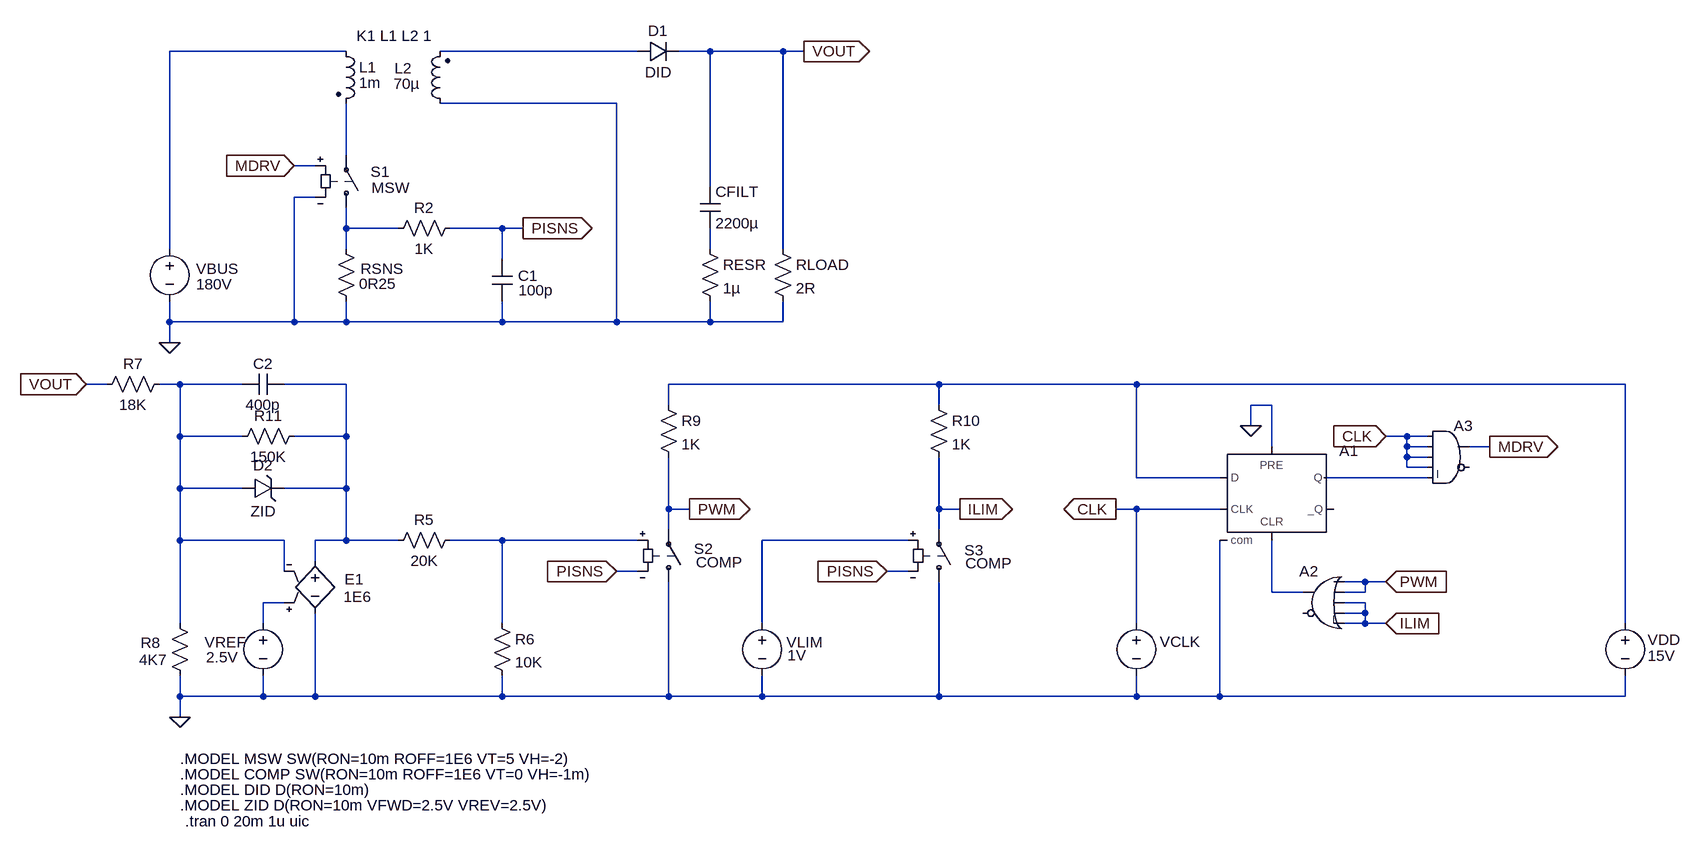
[diagram p0: schematic 384x_Flyback.asc]
384x_Flyback.asc, the LTspice schematic file:
Version 4
SHEET 1 2288 1304
WIRE 224 256 224 176
WIRE 224 336 224 368
WIRE 224 368 304 368
WIRE 224 368 224 400
WIRE 464 416 464 368
WIRE 464 368 384 368
WIRE 464 480 464 512
WIRE 464 512 224 512
WIRE 224 512 224 480
WIRE 496 368 464 368
WIRE 368 176 640 176
WIRE 640 176 640 512
WIRE 640 512 464 512
WIRE 672 96 368 96
WIRE 176 320 144 320
WIRE 144 320 144 512
WIRE 144 512 224 512
WIRE 176 272 144 272
WIRE 784 304 784 96
WIRE 784 96 736 96
WIRE 784 368 784 400
WIRE 784 480 784 512
WIRE 784 512 640 512
WIRE 224 96 -48 96
WIRE -48 96 -48 400
WIRE -48 480 -48 512
WIRE -48 512 144 512
WIRE -48 544 -48 512
WIRE 896 400 896 96
WIRE 896 96 784 96
WIRE 896 480 896 512
WIRE 896 512 784 512
WIRE 96 976 96 944
WIRE 96 944 128 944
WIRE 96 1056 96 1088
WIRE 176 960 176 1088
WIRE 176 1088 96 1088
WIRE 176 880 176 848
WIRE 176 848 224 848
WIRE 384 848 464 848
WIRE 464 848 464 976
WIRE 464 1056 464 1088
WIRE 464 1088 176 1088
WIRE 672 848 464 848
WIRE 672 896 640 896
WIRE 720 912 720 1088
WIRE 720 1088 464 1088
WIRE 1088 896 1056 896
WIRE 1136 912 1136 1088
WIRE 864 976 864 848
WIRE 864 848 1088 848
WIRE 864 1056 864 1088
WIRE 864 1088 1136 1088
WIRE -32 848 -32 976
WIRE -32 848 128 848
WIRE 128 848 128 896
WIRE -32 1056 -32 1088
WIRE -144 608 -176 608
WIRE 928 96 896 96
WIRE 96 1088 -32 1088
WIRE -32 1088 -32 1120
WIRE 720 1088 864 1088
WIRE 720 720 720 800
WIRE 1136 720 1136 800
WIRE 752 800 720 800
WIRE 720 800 720 832
WIRE 1168 800 1136 800
WIRE 1136 800 1136 832
WIRE 720 640 720 608
WIRE 720 608 1136 608
WIRE 1136 640 1136 608
WIRE 1136 608 1440 608
WIRE 1440 976 1440 800
WIRE 1440 800 1568 800
WIRE 1440 1056 1440 1088
WIRE 1440 1088 1136 1088
WIRE 1440 800 1408 800
WIRE 1648 704 1648 640
WIRE 1648 640 1616 640
WIRE 1616 640 1616 672
WIRE 1568 752 1440 752
WIRE 1440 752 1440 608
WIRE 1440 608 2192 608
WIRE 2192 608 2192 976
WIRE 2192 1056 2192 1088
WIRE 2192 1088 1568 1088
WIRE 1728 752 1888 752
WIRE 1568 848 1568 1088
WIRE 1568 1088 1440 1088
WIRE 1696 928 1648 928
WIRE 1648 928 1648 848
WIRE 1760 912 1792 912
WIRE 1760 928 1792 928
WIRE 1792 928 1792 912
WIRE 1760 944 1792 944
WIRE 1792 944 1792 960
WIRE 1792 976 1760 976
WIRE 1760 960 1792 960
WIRE 1792 960 1792 976
WIRE 1792 976 1824 976
WIRE 1792 912 1824 912
WIRE 224 608 224 688
WIRE 224 848 304 848
WIRE 1984 704 1952 704
WIRE 1888 736 1856 736
WIRE 1856 736 1856 720
WIRE 1856 688 1888 688
WIRE 1888 704 1856 704
WIRE 1856 704 1856 688
WIRE 1888 720 1856 720
WIRE 1856 720 1856 704
WIRE 1856 688 1824 688
WIRE -64 608 -32 608
WIRE -32 608 -32 688
WIRE 64 608 -32 608
WIRE 128 608 224 608
WIRE 128 768 224 768
WIRE 224 768 224 848
WIRE -32 768 64 768
WIRE -32 768 -32 848
WIRE 144 688 224 688
WIRE 224 688 224 768
WIRE 64 688 -32 688
WIRE -32 688 -32 768
FLAG 496 368 PISNS
IOPIN 496 368 Out
FLAG 144 272 MDRV
IOPIN 144 272 In
FLAG -48 544 0
FLAG -32 1120 0
FLAG 640 896 PISNS
IOPIN 640 896 In
FLAG 1056 896 PISNS
IOPIN 1056 896 In
FLAG -176 608 VOUT
IOPIN -176 608 In
FLAG 928 96 VOUT
IOPIN 928 96 Out
FLAG 752 800 PWM
IOPIN 752 800 Out
FLAG 1168 800 ILIM
IOPIN 1168 800 Out
FLAG 1408 800 CLK
IOPIN 1408 800 Out
FLAG 1616 672 0
FLAG 1984 704 MDRV
IOPIN 1984 704 Out
FLAG 1824 912 PWM
IOPIN 1824 912 In
FLAG 1824 976 ILIM
IOPIN 1824 976 In
FLAG 1824 688 CLK
IOPIN 1824 688 In
SYMBOL sw 224 352 M180
WINDOW 0 37 71 Left 0
WINDOW 3 39 46 Left 0
SYMATTR InstName S1
SYMATTR Value MSW
SYMBOL ind2 208 80 R0
WINDOW 3 36 64 Left 0
SYMATTR InstName L1
SYMATTR Value 1m
SYMATTR Type ind
SYMBOL ind2 384 192 R180
WINDOW 0 59 70 Left 0
WINDOW 3 47 46 Left 0
SYMATTR InstName L2
SYMATTR Value 70µ
SYMATTR Type ind
SYMBOL res 208 384 R0
WINDOW 0 38 46 Left 0
WINDOW 3 36 69 Left 0
SYMATTR InstName RSNS
SYMATTR Value 0R25
SYMBOL res 400 352 R90
WINDOW 0 0 56 VBottom 0
WINDOW 3 32 56 VTop 0
SYMATTR InstName R2
SYMATTR Value 1K
SYMBOL cap 448 416 R0
WINDOW 0 40 25 Left 0
WINDOW 3 41 47 Left 0
SYMATTR InstName C1
SYMATTR Value 100p
SYMBOL diode 672 112 R270
WINDOW 0 32 32 VTop 0
WINDOW 3 0 32 VBottom 0
SYMATTR InstName D1
SYMATTR Value DID
SYMBOL cap 768 304 R0
SYMATTR InstName CFILT
SYMATTR Value 2200µ
SYMBOL res 768 384 R0
SYMATTR InstName RESR
SYMATTR Value 1µ
SYMBOL voltage -48 384 R0
WINDOW 0 41 46 Left 0
WINDOW 3 41 70 Left 0
SYMATTR InstName VBUS
SYMATTR Value 180V
SYMBOL res 880 384 R0
SYMATTR InstName RLOAD
SYMATTR Value 2R
SYMBOL e2 176 864 R0
WINDOW 0 45 44 Left 0
WINDOW 3 44 71 Left 0
SYMATTR InstName E1
SYMATTR Value 1E6
SYMBOL voltage 96 960 R0
WINDOW 0 -90 45 Left 0
WINDOW 3 -88 68 Left 0
SYMATTR InstName VREF
SYMATTR Value 2.5V
SYMBOL res 400 832 R90
WINDOW 0 0 56 VBottom 0
WINDOW 3 32 56 VTop 0
SYMATTR InstName R5
SYMATTR Value 20K
SYMBOL res 448 960 R0
SYMATTR InstName R6
SYMATTR Value 10K
SYMBOL sw 720 928 M180
WINDOW 0 39 67 Left 0
WINDOW 3 42 46 Left 0
SYMATTR InstName S2
SYMATTR Value COMP
SYMBOL sw 1136 928 M180
WINDOW 0 39 65 Left 0
WINDOW 3 41 45 Left 0
SYMATTR InstName S3
SYMATTR Value COMP
SYMBOL voltage 864 960 R0
WINDOW 0 37 45 Left 0
WINDOW 3 39 65 Left 0
WINDOW 123 0 0 Left 0
WINDOW 39 0 0 Left 0
SYMATTR InstName VLIM
SYMATTR Value 1V
SYMBOL res -48 592 R90
WINDOW 0 0 56 VBottom 0
WINDOW 3 32 56 VTop 0
SYMATTR InstName R7
SYMATTR Value 18K
SYMBOL res -16 1072 R180
WINDOW 0 46 66 Left 0
WINDOW 3 36 40 Left 0
SYMATTR InstName R8
SYMATTR Value 4K7
SYMBOL res 704 624 R0
SYMATTR InstName R9
SYMATTR Value 1K
SYMBOL res 1120 624 R0
SYMATTR InstName R10
SYMATTR Value 1K
SYMBOL Digital\\dflop 1648 704 R0
SYMATTR InstName A1
SYMATTR SpiceLine VHIGH=15 VLOW=0 TRISE=10N TFALL=10N
SYMBOL voltage 1440 960 R0
WINDOW 0 36 44 Left 0
WINDOW 3 36 63 Invisible 0
WINDOW 123 0 0 Left 0
WINDOW 39 0 0 Left 0
SYMATTR InstName VCLK
SYMATTR Value PULSE(0 15 0 10n 10n 9u 10u)
SYMBOL voltage 2192 960 R0
WINDOW 0 35 41 Left 0
WINDOW 3 35 66 Left 0
WINDOW 123 0 0 Left 0
WINDOW 39 0 0 Left 0
SYMATTR InstName VDD
SYMATTR Value 15V
SYMBOL Digital\\or 1728 880 M0
SYMATTR InstName A2
SYMATTR SpiceLine VHIGH=15 VLOW=0 TRISE=10N TFALL=10N
SYMBOL cap 128 592 R90
WINDOW 0 0 32 VBottom 0
WINDOW 3 32 32 VTop 0
SYMATTR InstName C2
SYMATTR Value 400p
SYMBOL Digital\\and 1920 656 R0
SYMATTR InstName A3
SYMATTR SpiceLine VHIGH=15 VLOW=0 TRISE=10N TFALL=10N
SYMBOL zener 64 784 R270
WINDOW 0 36 32 VTop 0
WINDOW 3 -4 32 VBottom 0
SYMATTR InstName D2
SYMATTR Value ZID
SYMBOL res 160 672 R90
WINDOW 0 0 56 VBottom 0
WINDOW 3 32 56 VTop 0
SYMATTR InstName R11
SYMATTR Value 150K
TEXT 240 72 Left 0 !K1 L1 L2 1
TEXT -24 1280 Left 0 !.tran 0 20m 1u uic
TEXT -32 1184 Left 0 !.MODEL MSW SW(RON=10m ROFF=1E6 VT=5 VH=-2)
TEXT -32 1208 Left 0 !.MODEL COMP SW(RON=10m ROFF=1E6 VT=0 VH=-1m)
TEXT -32 1232 Left 0 !.MODEL DID D(RON=10m)
TEXT -32 1256 Left 0 !.MODEL ZID D(RON=10m VFWD=2.5V VREV=2.5V)

The netlist it stands for:
* 384x_Flyback.asc
S1 N002 N001 MDRV 0 MSW
L1 N005 N001 1m
L2 0 N003 70µ
RSNS N002 0 0R25
R2 PISNS N002 1K
C1 PISNS 0 100p
D1 N003 VOUT DID
CFILT VOUT N004 2200µ
RESR N004 0 1µ
VBUS N005 0 180V
RLOAD VOUT 0 2R
E1 N007 0 N006 N010 1E6
VREF N006 0 2.5V
R5 N008 N007 20K
R6 N008 0 10K
S2 0 PWM N008 PISNS COMP
S3 0 ILIM N009 PISNS COMP
VLIM N009 0 1V
R7 N010 VOUT 18K
R8 0 N010 4K7
R9 N011 PWM 1K
R10 N011 ILIM 1K
A1 N011 0 CLK 0 N013 0 N012 0 DFLOP VHIGH=15 VLOW=0 TRISE=10N TFALL=10N
VCLK CLK 0 PULSE(0 15 0 10n 10n 9u 10u)
VDD N011 0 15V
A2 PWM PWM ILIM ILIM ILIM 0 N013 0 OR VHIGH=15 VLOW=0 TRISE=10N TFALL=10N
C2 N007 N010 400p
A3 CLK CLK CLK CLK N012 0 MDRV 0 AND VHIGH=15 VLOW=0 TRISE=10N TFALL=10N
D2 N010 N007 ZID
R11 N007 N010 150K
.model D D
.lib standard.dio
K1 L1 L2 1
.tran 0 20m 1u uic
.MODEL MSW SW(RON=10m ROFF=1E6 VT=5 VH=-2)
.MODEL COMP SW(RON=10m ROFF=1E6 VT=0 VH=-1m)
.MODEL DID D(RON=10m)
.MODEL ZID D(RON=10m VFWD=2.5V VREV=2.5V)
.backanno
.end